# EAGLE schematic Spinning (EAGLE 6.2)
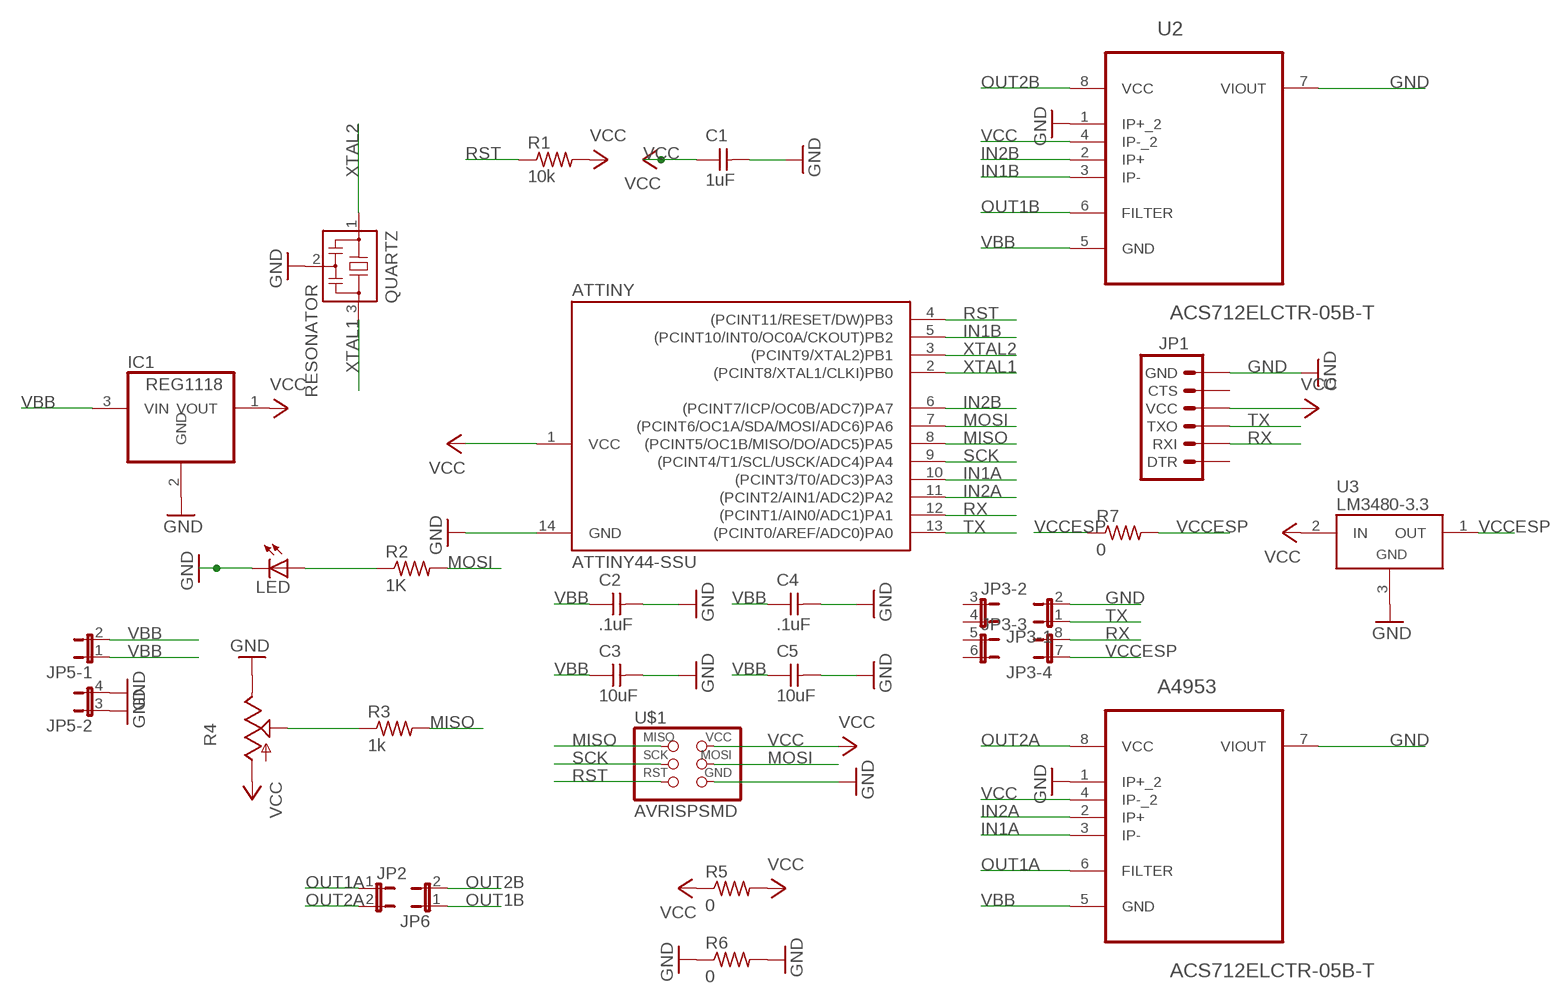
[diagram p0: schematic, sheet 1]

## Parts
A4953  ACS712ELCTR-05B-T  [SOIC127P600X175-8N]
ATTINY  ATTINY44-SSU  [SOIC14]
C1  1uF  UNPOLARIZED_CAPACITOR1206  [1206]
C2  .1uF  UNPOLARIZED_CAPACITOR1206  [1206]
C3  10uF  UNPOLARIZED_CAPACITOR1206  [1206]
C4  .1uF  UNPOLARIZED_CAPACITOR1206  [1206]
C5  10uF  UNPOLARIZED_CAPACITOR1206  [1206]
IC1  REG1118  [SOT223]
JP1  ARDUINO_SERIAL_PROGRAMLONGPADS  [1X06_LONGPADS]
JP2  JP1E  [JP1]
JP3  JP4QE  [JP4Q]
JP5  JP2QE  [JP2Q]
JP6  JP1E  [JP1]
LED  LED1206  [1206]
QUARTZ  RESONATOR  [EFOBM]
R1  10k  RESISTOR1206  [1206]
R2  1K  RESISTOR1206  [1206]
R3  1k  RESISTOR1206  [1206]
R4  TRIM_US-CIP20C-6MM  [CIP20C-6MM]
R5  0  RESISTOR1206  [1206]
R6  0  RESISTOR1206  [1206]
R7  0  RESISTOR1206  [1206]
U2  ACS712ELCTR-05B-T  [SOIC127P600X175-8N]
U3  LM3480-3.3  [SOT-23-3]
U$1  AVRISPSMD  [2X03SMD]

## Nets
GND: A4953.1(IP+_2) A4953.7(VIOUT) ATTINY.14(GND) C1.2 C2.2 C3.2 C4.2 C5.2 IC1.2(GND) JP1.6(GND) JP3.2 JP5.3 JP5.4 LED.2(C) QUARTZ.2 R4.E R6.1 R6.2 U2.1(IP+_2) U2.7(VIOUT) U3.3(GND) U$1.6(GND)
IN1A: A4953.3(IP-) ATTINY.10((PCINT3/T0/ADC3)PA3)
IN1B: ATTINY.5((PCINT10/INT0/OC0A/CKOUT)PB2) U2.3(IP-)
IN2A: A4953.2(IP+) ATTINY.11((PCINT2/AIN1/ADC2)PA2)
IN2B: ATTINY.6((PCINT7/ICP/OC0B/ADC7)PA7) U2.2(IP+)
LEDRES: LED.1(A) R2.1
LEDRES1: R3.1 R4.S
MISO: ATTINY.8((PCINT5/OC1B/MISO/DO/ADC5)PA5) R3.2 U$1.1(MISO)
MOSI: ATTINY.7((PCINT6/OC1A/SDA/MOSI/ADC6)PA6) R2.2 U$1.4(MOSI)
OUT1A: A4953.6(FILTER) JP2.1
OUT1B: JP6.1 U2.6(FILTER)
OUT2A: A4953.8(VCC) JP2.2
OUT2B: JP6.2 U2.8(VCC)
RST: ATTINY.4((PCINT11/RESET/DW)PB3) R1.1 U$1.5(RST)
RX: ATTINY.12((PCINT1/AIN0/ADC1)PA1) JP1.2(RXI) JP3.8
SCK: ATTINY.9((PCINT4/T1/SCL/USCK/ADC4)PA4) U$1.3(SCK)
TX: ATTINY.13((PCINT0/AREF/ADC0)PA0) JP1.3(TXO) JP3.1
VBB: A4953.5(GND) C2.1 C3.1 C4.1 C5.1 IC1.3(VIN) JP5.1 JP5.2 U2.5(GND)
VCC: A4953.4(IP-_2) ATTINY.1(VCC) C1.1 IC1.1(VOUT) JP1.4(VCC) R1.2 R4.A R5.1 R5.2 U2.4(IP-_2) U3.2(IN) U$1.2(VCC)
VCCESP: JP3.7 R7.1 R7.2 U3.1(OUT)
XTAL1: ATTINY.2((PCINT8/XTAL1/CLKI)PB0) QUARTZ.3
XTAL2: ATTINY.3((PCINT9/XTAL2)PB1) QUARTZ.1
Unconnected: JP1.1(DTR) JP1.5(CTS) JP3.3 JP3.4 JP3.5 JP3.6

## Library data of the parts
A4953 U2 = Allegro_By_element14_Batch_1:ACS712ELCTR-05B-T: Linear Current Sensor; MPN: ACS712ELCTR-05B-T; OC_FARNELL: 1329623; OC_NEWARK: 27M3644; PACKAGE: SOIC-8; SUPPLIER: Allegro
ATTINY = fab:ATTINY44
C1-C5 = FAB_Hello:UNPOLARIZED_CAPACITOR: unpolarized_capacitor
IC1 = burr-brown:REG1118: 800mA Low Dropout (LDO) Positive Regulator with Current Source and Sink Capability; MPN: REG1118-2.85/2K5G4; OC_FARNELL: unknown; OC_NEWARK: 14M2185
JP1 = SparkFun-Connectors:ARDUINO_SERIAL_PROGRAM: FTDI connector footprints
JP2 JP6 = jumper:JP1E: JUMPER
JP3 = jumper:JP4QE: JUMPER
JP5 = jumper:JP2QE: JUMPER
LED = ng:LED
QUARTZ = fab:RESONATOR
R1-R3 R5-R7 = ng:RESISTOR
R4 = pot:TRIM_US-: POTENTIOMETER
U3 = regulators:LM3480-*: National Semiconductor LM3480 100 mA, SOT-23, quasi-LDO linear regulator
U$1 = fab:AVRISP